# EAGLE schematic PCB-3.5MM Input Adapter (EAGLE 9.5.2)
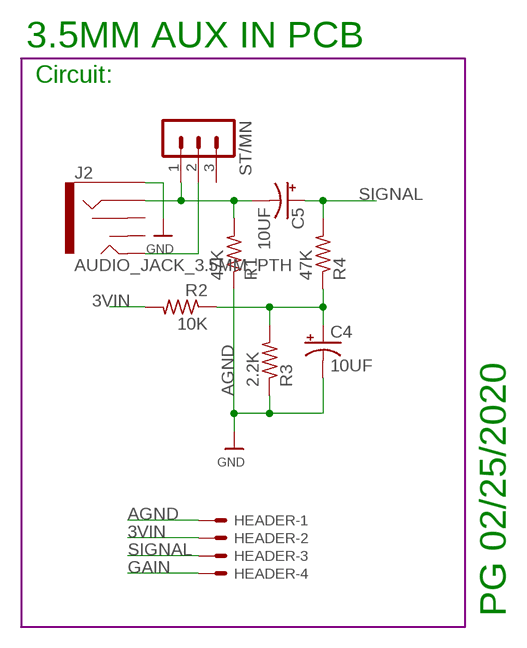
[diagram p0: schematic, sheet 1]

## Parts
C4  10UF  CPOL-USE5-8.5  [E5-8,5]
C5  10UF  CPOL-USE5-8.5  [E5-8,5]
HEADER  KK-156-4  [KK-156-4]
J2  AUDIO_JACK_3.5MM_PTH  [AUDIO-JACK]
R1  47K  R-US_R1206  [R1206]
R2  10K  R-US_R1206  [R1206]
R3  2.2K  R-US_R1206  [R1206]
R4  47K  R-US_R1206  [R1206]
ST/MN  MA03-1  [MA03-1]

## Nets
3VIN: HEADER.2 R2.2
AGND: C4.- HEADER.1 J2.SLEEVE R1.1 R3.1 ; supply symbol labelled GND
GAIN: HEADER.4
HP1: C4.+ R2.1 R3.2 R4.1
N$2: J2.TIP ST/MN.2
N$4: C5.- J2.RING R1.2 ST/MN.1
SIGNAL: C5.+ HEADER.3 R4.2
Unconnected: J2.RSH J2.TSH ST/MN.3

## Notes on the sheet
- 3.5MM AUX IN PCB
- Circuit:
- PG 02/25/2020

## Library data of the parts
C4 C5 = adafruit:CPOL-US: POLARIZED CAPACITOR, American symbol
HEADER = con-molex:KK-156-4: KK 156 HEADER Source: http://www.molex.com/pdm_docs/sd/026604100_sd.pdf; MF: MOLEX; OC_FARNELL: unknown; OC_NEWARK: unknown
J2 = SparkFun-Connectors:AUDIO_JACK_3.5MM: Audio Jack 3.5mm variants of PTH and SMT stereo audio jack with bypass switches. SparkFun Products: SparkFun SparkPunk Sound Kit <[https://www.sparkfun.com/products/11177]> - PTH MP3 Trigger <https://www.sparkfun.com/products/13720> -3.5mm SMD SparkFun PicoBoard <https://www.sparkfun.com/products/11888>- 2.5mm SMD; PROD_ID: CONN-08774; SF_ID: PRT-08032
R1-R4 = adafruit:R-US_: RESISTOR, American symbol
ST/MN = con-lstb:MA03-1: PIN HEADER; OC_FARNELL: unknown; OC_NEWARK: unknown